# Altium project PCB_Project.PrjPcb
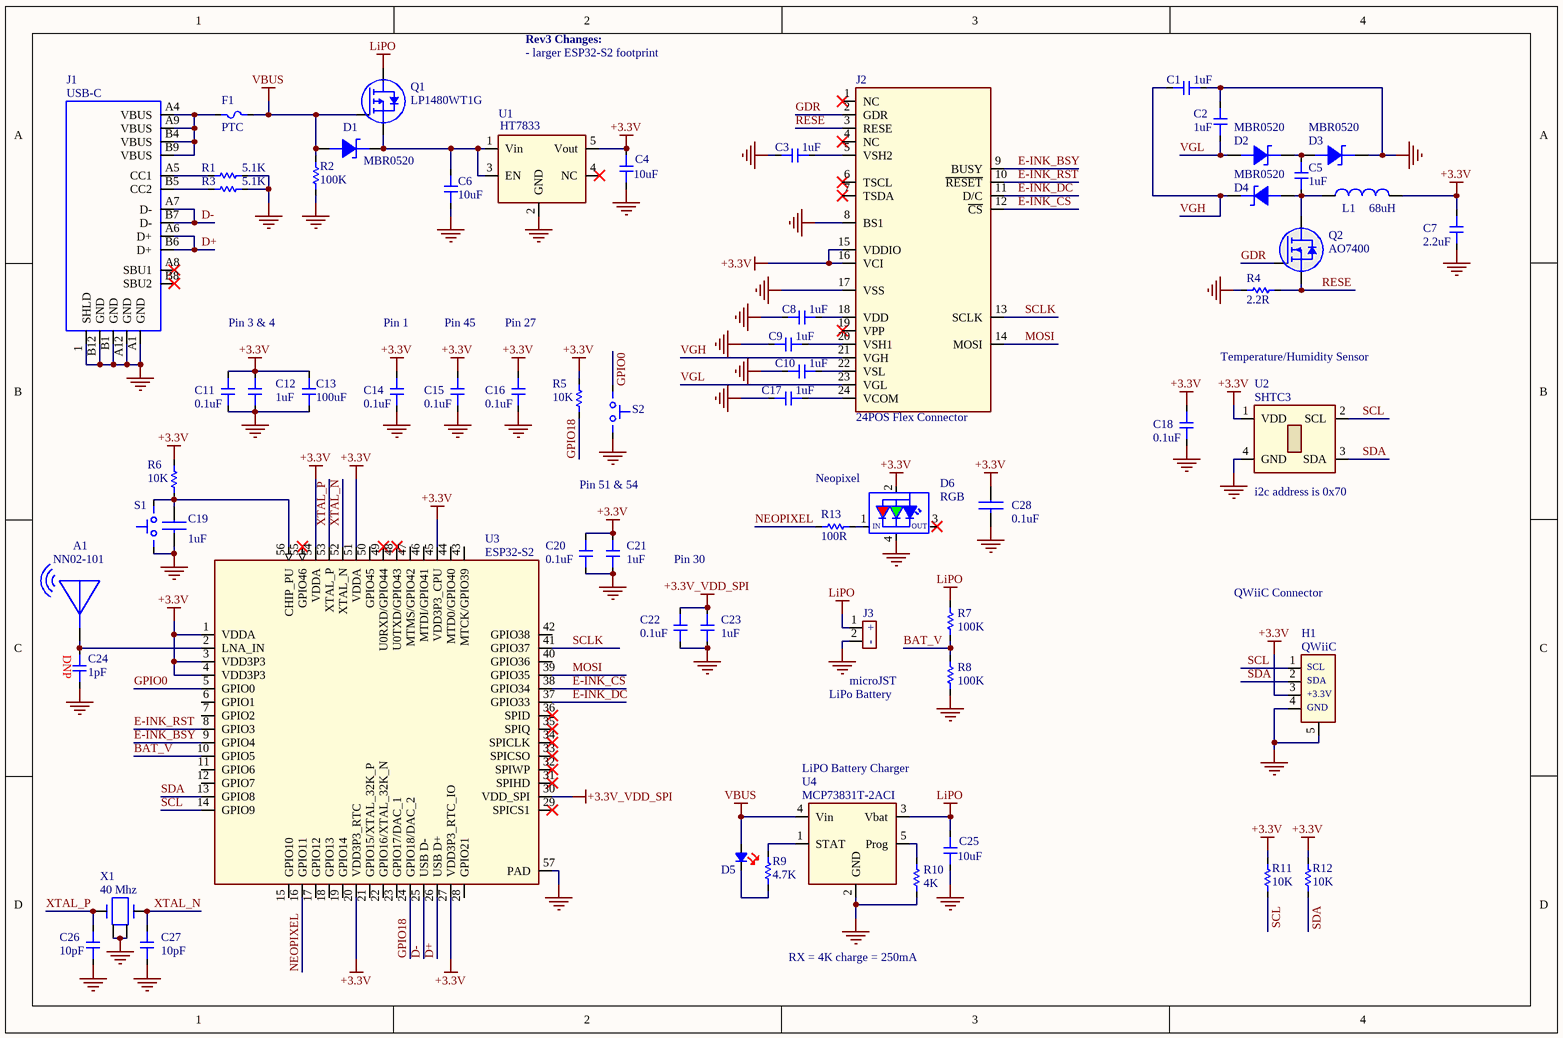
[diagram p0: Schematic_Rev3.SchDoc]
1 sheet, 63 parts. Net scope: global (net labels, ports and power ports of the same name join across sheets).
Board file: PCB_Rev3.PcbDoc

## Sheet Schematic_Rev3.SchDoc
size A4; SheetNumber: 1; SheetTotal: 1

### Parts
A1  NN02-101  [NN02-101]
C1  1uF  [CAPC1005X56N]
C2  1uF  [CAPC1005X56N]
C3  1uF  [CAPC1005X56N]
C4  10uF  [CAPC2012X140N]
C5  1uF  [CAPC1005X56N]
C6  10uF  [CAPC2012X140N]
C7  2.2uF  [CAPC1608X09L]
C8  1uF  [CAPC1005X56N]
C9  1uF  [CAPC1005X56N]
C10  1uF  [CAPC1005X56N]
C11  0.1uF  [CAPC1005X56N]
C12  1uF  [CAPC1005X56N]
C13  100uF  [CAPC3216X160N]
C14  0.1uF  [CAPC1005X56N]
C15  0.1uF  [CAPC1005X56N]
C16  0.1uF  [CAPC1005X56N]
C17  1uF  [CAPC1005X56N]
C18  0.1uF  [CAPC1005X56N]
C19  1uF  [CAPC1005X56N]
C20  0.1uF  [CAPC1005X56N]
C21  1uF  [CAPC1005X56N]
C22  0.1uF  [CAPC1005X56N]
C23  1uF  [CAPC1005X56N]
C24  1pF  [CAPC1005X56N]
C25  10uF  [CAPC2012X140N]
C26  10pF  [CAPC1005X56N]
C27  10pF  [CAPC1005X56N]
C28  0.1uF  [CAPC1005X56N]
D1  MBR0520  [SOD123]
D2  value MBR0520  [SOD123]  (hidden comment: MBR0520-TP)
D3  value MBR0520  [SOD123]  (hidden comment: MBR0520-TP)
D4  value MBR0520  [SOD123]  (hidden comment: MBR0520-TP)
D5  Red Led  [LED1005X40N-Red]  (value not drawn)
D6  RGB  [SK6805-E-J]
F1  TLC-PSMD050  [RESC1608X06L (0603 FOOTPRINT)]  (value not drawn)
H1  QWiiC  [SM04B-SRSS-TB]
J1  USB-C  [TYPE-C-31-M-12]
J2  24POS Flex Connector  [687124182122]
J3  CON2  [JST_Micro_2PIN]  (value not drawn)  (no BOM)
L1  68uH  [INDUCTOR, 3mmX3mm]
Q1  LP1480WT1G  [SC-70]
Q2  AO7400  [SC-70]
R1  5.1K  [RESC1005X40L (0402 FOOTPRINT)]
R2  100K  [RESC1005X40L (0402 FOOTPRINT)]
R3  5.1K  [RESC1005X40L (0402 FOOTPRINT)]
R4  2.2R  [RESC1005X40L (0402 FOOTPRINT)]
R5  10K  [RESC1005X40L (0402 FOOTPRINT)]
R6  10K  [RESC1005X40L (0402 FOOTPRINT)]
R7  100K  [RESC1005X40L (0402 FOOTPRINT)]
R8  100K  [RESC1005X40L (0402 FOOTPRINT)]
R9  4.7K  [RESC1005X40L (0402 FOOTPRINT)]
R10  4K  [RESC1005X40L (0402 FOOTPRINT)]
R11  10K  [RESC1005X40L (0402 FOOTPRINT)]
R12  10K  [RESC1005X40L (0402 FOOTPRINT)]
R13  100R  [RESC1005X40L (0402 FOOTPRINT)]
S1  (no value)  [TS-1088R-02526]
S2  (no value)  [TS-1088R-02526]
U1  HT7833  [SOT95P280X144-5N]
U2  SHTC3  [DFN-4 (2.0mm X 2.0mm)]
U3  ESP32-S2  [QFN56_0.4mm pitch - Rev2]
U4  value MCP73831T-2ACI  [SOT95P280X144-5N]  (hidden comment: MCP73831T-2ACI/OT)
X1  40 Mhz  [OSC20X16]

### Nets
+3.3V: C4.1 C7.1 C11.1 C12.1 C13.1 C14.1 C15.1 C16.1 C18.1 C20.1 C21.1 C28.1 D6.2(VDD) H1.3 J2.15(VDDIO) J2.16(VCI) L1.2 R5.1 R6.1 R11.2 R12.2 U1.5(Vout) U2.1(VDD) U3.1(VDDA) U3.3(VDD3P3) U3.4(VDD3P3) U3.20(VDD3P3_RTC) U3.27(VDD3P3_RTC_IO) U3.45(VDD3P3_CPU) U3.51(VDDA) U3.54(VDDA)
+3.3V_VDD_SPI: C22.1 C23.1 U3.30(VDD_SPI)
GND: C1.2 C2.1 C3.1 C4.2 C6.2 C7.2 C8.1 C9.1 C10.1 C11.2 C12.2 C13.2 C14.2 C15.2 C16.2 C17.1 C18.2 C19.2 C20.2 C21.2 C22.2 C23.2 C24.2 C25.2 C26.2 C27.2 C28.2 D3.1(Cathode) D6.4(GND) H1.4 H1.5 J1.1(SHLD) J1.A1(GND) J1.A12(GND) J1.B1(GND) J1.B12(GND) J2.8(BS1) J2.17(VSS) J3.2 R1.1 R2.2 R3.1 R4.2 R8.1 R10.1 S1.2(B) S2.2(B) U1.2(GND) U2.4(GND) U3.57(PAD) U4.2(GND) X1.2 X1.4
LiPO: C25.1 J3.1 Q1.3(D) R7.2 U4.3(Vbat)
VBUS: D1.2(Annode) D5.2 F1.1 Q1.1(G) R2.1 U4.4(Vin)
BAT_V: R7.1 R8.2 U3.10(GPIO5)
D+: J1.A6(D+) J1.B6(D+) U3.26(USB_D+)
D-: J1.A7(D-) J1.B7(D-) U3.25(USB_D-)
E-INK_BSY: J2.9(BUSY) U3.9(GPIO4)
E-INK_CS: J2.12(~{CS}) U3.38(GPIO34)
E-INK_DC: J2.11(D/C) U3.37(GPIO33)
E-INK_RST: J2.10(~{RESET}) U3.8(GPIO3)
GDR: J2.2(GDR) Q2.1(G)
GPIO0: S2.1(A) U3.5(GPIO0)
GPIO18: R5.2 U3.24(GPIO18/DAC_2)
MOSI: J2.14(MOSI) U3.39(GPIO35)
NEOPIXEL: R13.2 U3.16(GPIO11)
RESE: J2.3(RESE) Q2.2(S) R4.1
SCL: H1.1 R11.1 U2.2(SCL) U3.14(GPIO9)
SCLK: J2.13(SCLK) U3.41(GPIO37)
SDA: H1.2 R12.1 U2.3(SDA) U3.13(GPIO8)
VGH: C1.1 D4.1(Cathode) J2.21(VGH)
VGL: C2.2 D2.2(Annode) J2.23(VGL)
XTAL_N: C27.1 U3.52(XTAL_N) X1.3
XTAL_P: C26.1 U3.53(XTAL_P) X1.1
NetA1_1: A1.1 C24.1 U3.2(LNA_IN)
NetC3_2: C3.2 J2.5(VSH2)
NetC5_1: C5.1 D2.1(Cathode) D3.2(Annode)
NetC5_2: C5.2 D4.2(Annode) L1.1 Q2.3(D)
NetC6_1: C6.1 D1.1(Cathode) Q1.2(S) U1.1(Vin) U1.3(EN)
NetC8_2: C8.2 J2.18(VDD)
NetC9_2: C9.2 J2.20(VSH1)
NetC10_2: C10.2 J2.22(VSL)
NetC17_2: C17.2 J2.24(VCOM)
NetC19_1: C19.1 R6.2 S1.1(A) U3.56(CHIP_PU)
NetD5_1: D5.1 R9.1
NetD6_1: D6.1(DIN) R13.1
NetF1_2: F1.2 J1.A4(VBUS) J1.A9(VBUS) J1.B4(VBUS) J1.B9(VBUS)
NetJ1_A5: J1.A5(CC1) R1.2
NetJ1_B5: J1.B5(CC2) R3.2
NetR9_2: R9.2 U4.1(STAT)
NetR10_2: R10.2 U4.5(Prog)

Not connected (* = marked no-connect by the designer): D6 3(DOUT)*; J1 A8(SBU1)* B8(SBU2)*; J2 1(NC)* 4(NC)* 6(TSCL)* 7(TSDA)* 19(VPP)*; U1 4(NC)*; U3 6(GPIO1) 7(GPIO2) 11(GPIO6) 12(GPIO7) 15(GPIO10) 17(GPIO12) 18(GPIO13) 19(GPIO14) 21(GPIO15/XTAL_32K_P) 22(GPIO16/XTAL_32K_N) 23(GPIO17/DAC_1) 28(GPIO21) 29(SPICS1)* 31(SPIHD)* 32(SPIWP)* 33(SPICSO)* 34(SPICLK)* 35(SPIQ)* 36(SPID)* 40(GPIO36) 42(GPIO38) 43(MTCK/GPIO39) 44(MTD0/GPIO40) 46(MTDI/GPIO41) 47(MTMS/GPIO42) 48(U0TXD/GPIO43)* 49(U0RXD/GPIO44)* 50(GPIO45) 55(GPIO46)*

### Notes on the sheet
- Rev3 Changes:
- - larger ESP32-S2 footprint
- (near F1) PTC
- Pin 3 & 4
- Pin 1
- Pin 45
- Pin 27
- Temperature/Humidity Sensor
- Pin 51 & 54
- (near D6) Neopixel
- (near U2) i2c address is 0x70
- Pin 30
- (near C24) DNP
- QWiiC Connector
- LiPo Battery
- microJST
- (near U4) LiPO Battery Charger
- RX = 4K charge = 250mA
- (in symbol JST_Micro_CONN_2PIN) +; -
- (in symbol SK6805-E-J-1515) IN; OUT
- (in symbol SM04B-SRSS-TB) SCL; SDA; +3.3V; GND

### Library data of the parts
A1 = NN02-101: Antenna Chip 2.4Gig; Manufacturer: Ignion; Vendor: Digi-Key; Value: Chip Antenna; Part_Number: NN02-101
C1-C3 C5 C8-C10 C17 = CAP_0402: CAP 1uF 0402; Part_Footprint: 0402; Value: 1uF
C4 C6 C25 = CAP_0805: CAP 10uF 0805; Part_Footprint: 0805; Value: 10uF
C7 = CAP_0402: CAP 2.2uF 0603; Part_Footprint: 0603; Value: 2.2uF
C11 C14-C16 C20 C22 C23 C28 = CAP_0402: CAP 0.1uF 0402; Part_Footprint: 0402; Vendor: LCSC
  C11 C14-C16 C20 C22 C28: Value: 0.1uF
  C23: Value: 1uF
C12 C21 = CAP_0402: CAP 1uF 0402; Part_Footprint: 0402; Vendor: LCSC; Value: 1uF
C13 = CAP_1206: CAP 100uF 1206; Part_Footprint: 1206; Value: 100uF
C18 = CAP_0402: CAP 0.1uF 0402; Part_Footprint: 0402; Value: 0.1uF
C19 = CAP_0402: CAP 1uF 0402; Value: 1uF
C24 = CAP_0402: CAP 1pF 0402; Part_Footprint: 0402; Value: 1pF
C26 C27 = CAP_0402: CAP 10pF 0402; Part_Footprint: 0402; Vendor: LCSC; Value: 10pF
D1-D4 = MBR0520-TP: DIODE SCHOTTKY 20V 500MA SOD-123; Manufacturer: Micro; Part_Number: C78746; Vendor: LCSC; Part_Footprint: SOD-123
  D1: Value: MBR0520
D5 = LED_0402_SMALL_Red: LED Red 0402; Part_Number: C364556; Manufacturer: Lite-On; Part_Footprint: 0402; Vendor: LCSC; Value: Red Led
D6 = SK6805-E-J-1515: LED,RGB,NEOPIXEL,SK6805-E-J 1515; Part_Number: 4492; Manufacturer: Adafruit; Vendor: Digi-Key; Part_Footprint: SMD-1515; Value: NeoPixel
F1 = PTC_FUSE: PTC FUSE 500mA hold, 1A trip; Manufacturer: TLC; Part_Number: C261942; Vendor: LCSC; Value: TLC-PSMD050
H1 = SM04B-SRSS-TB: CONN HEADER 4POS .100 R/A QWIIC; Manufacturer: JST; Part_Number: PRT-14417; Vendor: Digi-Key; Value: QWiiC
J1 = USB-C: CONN RECPT USB-C; Manufacturer: KHE; Part_Number: C165948; Part_Footprint: SMT; Vendor: LCSC; Value: USB-C
J2 = 687124182122: CONN FFC TOP/BOT 24POS 0.50MM R/A; Manufacturer: Wurth; Vendor: Digi-Key; Part_Number: 687124182122; Value: 24POS Flex Connector
J3 = JST_Micro_CONN_2PIN: JST MIcro CONN 2POS
L1 = 68uH: INDUCTOR 68uH 20% 4mmx4mm; Part_Number: C135265; Manufacturer: SXN; Vendor: LCSC; Part_Footprint: 4mmx4mm; Value: 68uH
Q1 = LP1480WT1G: MOSFET P-CH 20V 1.4A SC-70; Manufacturer: LRC; Part_Number: C172434; Vendor: LCSC; Part_Footprint: SC-70; Value: LP1480WT1G
Q2 = AO7400: MOSFET N-CH 20V 4A SC70-3; Manufacturer: VBSemi Elec; Vendor: LCSC; Part_Footprint: SC70-3; Part_Number: AO7400; Value: AO7400
R1 R3 = RES_0402: RES 5.1K 0402; Part_Footprint: 0402; Value: 5.1K
R2 R7 R8 = RES_0402: RES 100K 0402; Part_Footprint: 0402; Value: 100K
R4 = RES_0402: RES 2.2R 0402; Part_Footprint: 0402; Value: 2.2R
R5 R6 = RES_0402: RES 10K 0402; Manufacturer: Guangdong; Man_Part_Number: RC-02W1002FT; Vendor: LCSC; LCSC_Part_Number: C258091; Value: 10K
R9 = RES_0402: RES 4.7K 0402; Part_Footprint: 0402; Value: 4.7K
R10 = RES_0402: RES 4K 0402; Part_Footprint: 0402; Value: 4K
R11 R12 = RES_0402: RES 10K 0402; Part_Footprint: 0402; Value: 10K
R13 = RES_0603: RES 100R 0402; Manufacturer: Yageo; PartNumber: C106232; Man_Part_Number: RC0402FR-07100RL; Vendor: LCSC; Value: 100R
S1 S2 = TS-1088R-02526: Tactile Micro Switch; Part_Number: C455281; Manufacturer: XUNPU; Part_Footprint: SMD; Vendor: LCSC
U1 = HT7833: IC LDO 3.3V 0.5A SOT23-5; Manufacturer: Holtek; Part_Number: C164106; Vendor: LCSC; Value: HT7833; Part_Footprint: SOT23-5
U2 = SHTC3: Humidity/Temperature Sensor; Manufacturer: Sensirion; Vendor: LCSC; Value: Temp/Humid; Part_Number: SHTC3
U3 = ESP32-S2: WIFI/Bluetooth, w/ 4M Flash, 2M PSRAM, QFN-56 7x7; Manufacturer: Espressif; Part_Number: ESP32-S2FN4R2; Part_Footprint: QFN56; Vendor: Digi-Key; Value: ESP32-S2
U4 = MCP73831T-2ACI/OT: Charger IC Lithium-Ion/Polymer SOT23-5; Manufacturer: Microchip; Vendor: Digi-Key; Part_Number: MCP73831T-2ACI/OT
X1 = 40Mhz: CRYSTAL 40MHZ 10PF SMD; Part_Number: ECS-400-10-37B2-CKM; Manufacturer: ECS; Vendor: Digi-Key; Value: 40 Mhz